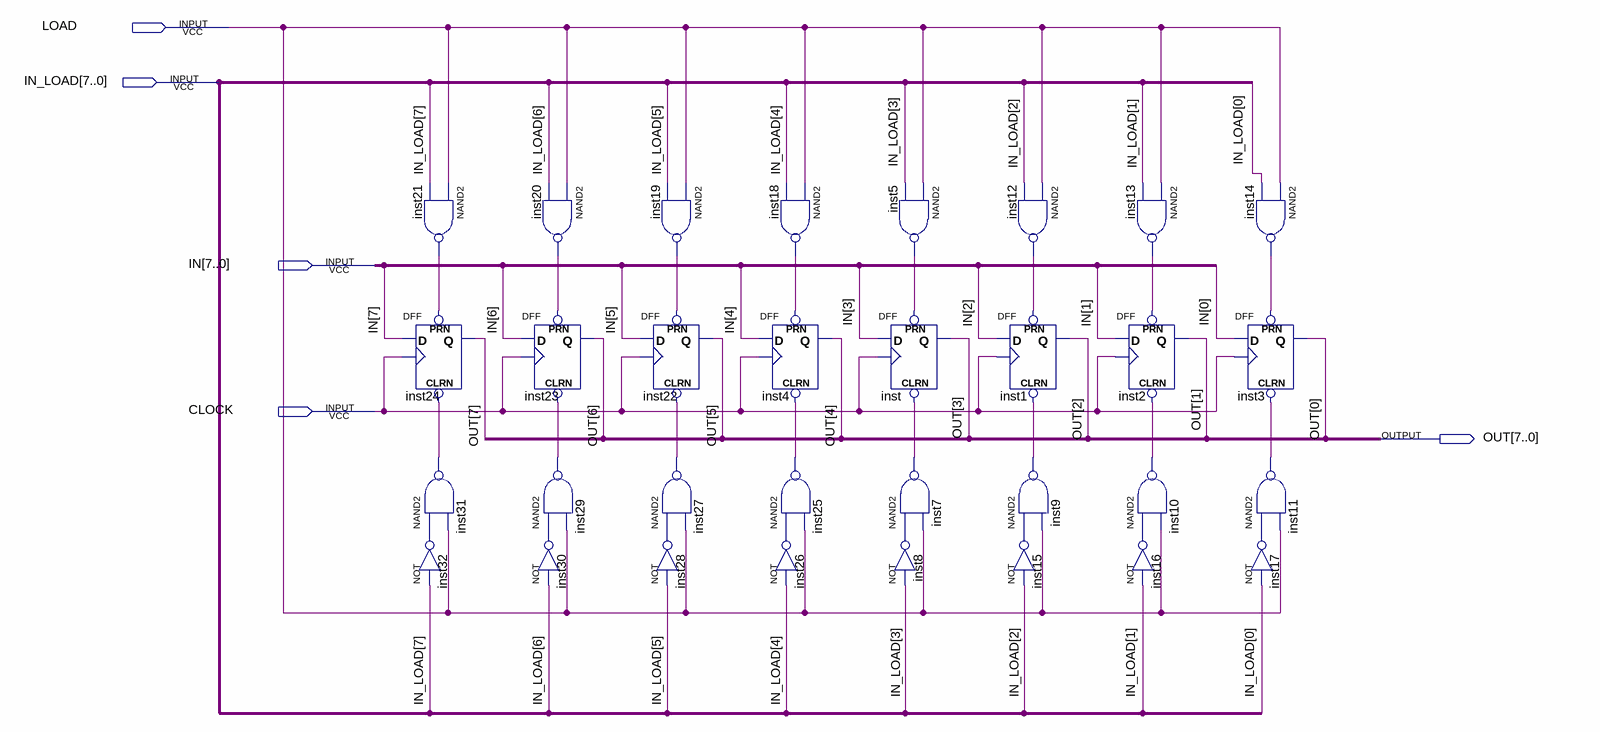
[diagram p0: schematic sheet]
// Quartus schematic Register_8bit.bdf as structural Verilog: 32 symbols, 5 pins
module Register_8bit (
  input  LOAD,
  input  [7:0] IN_LOAD,
  input  [7:0] IN,
  input  CLOCK,
  output [7:0] OUT
);

  wire inst5_out, inst7_out, inst8_out, inst9_out, inst10_out, inst11_out, inst12_out, inst13_out,
       inst14_out, inst15_out, inst16_out, inst17_out, inst18_out, inst19_out, inst20_out, inst21_out,
       inst25_out, inst26_out, inst27_out, inst28_out, inst29_out, inst30_out, inst31_out, inst32_out;

  nand inst21 (inst21_out, LOAD, IN_LOAD[7]);
  DFF inst24 (.CLRN(inst31_out), .CLK(CLOCK), .D(IN[7]), .PRN(inst21_out), .Q(OUT[7]));
  nand inst31 (inst31_out, inst32_out, LOAD);
  not inst32 (inst32_out, IN_LOAD[7]);
  DFF inst23 (.CLRN(inst29_out), .CLK(CLOCK), .D(IN[6]), .PRN(inst20_out), .Q(OUT[6]));
  nand inst20 (inst20_out, LOAD, IN_LOAD[6]);
  nand inst29 (inst29_out, inst30_out, LOAD);
  not inst30 (inst30_out, IN_LOAD[6]);
  nand inst19 (inst19_out, LOAD, IN_LOAD[5]);
  DFF inst22 (.CLRN(inst27_out), .CLK(CLOCK), .D(IN[5]), .PRN(inst19_out), .Q(OUT[5]));
  nand inst27 (inst27_out, inst28_out, LOAD);
  not inst28 (inst28_out, IN_LOAD[5]);
  nand inst18 (inst18_out, LOAD, IN_LOAD[4]);
  DFF inst4 (.CLRN(inst25_out), .CLK(CLOCK), .D(IN[4]), .PRN(inst18_out), .Q(OUT[4]));
  nand inst25 (inst25_out, inst26_out, LOAD);
  not inst26 (inst26_out, IN_LOAD[4]);
  nand inst5 (inst5_out, LOAD, IN_LOAD[3]);
  DFF inst (.CLRN(inst7_out), .CLK(CLOCK), .D(IN[3]), .PRN(inst5_out), .Q(OUT[3]));
  nand inst7 (inst7_out, inst8_out, LOAD);
  not inst8 (inst8_out, IN_LOAD[3]);
  nand inst12 (inst12_out, LOAD, IN_LOAD[2]);
  DFF inst1 (.CLRN(inst9_out), .CLK(CLOCK), .D(IN[2]), .PRN(inst12_out), .Q(OUT[2]));
  nand inst9 (inst9_out, inst15_out, LOAD);
  not inst15 (inst15_out, IN_LOAD[2]);
  nand inst13 (inst13_out, LOAD, IN_LOAD[1]);
  DFF inst2 (.CLRN(inst10_out), .CLK(CLOCK), .D(IN[1]), .PRN(inst13_out), .Q(OUT[1]));
  nand inst10 (inst10_out, inst16_out, LOAD);
  not inst16 (inst16_out, IN_LOAD[1]);
  nand inst14 (inst14_out, LOAD, IN_LOAD[0]);
  DFF inst3 (.CLRN(inst11_out), .CLK(CLOCK), .D(IN[0]), .PRN(inst14_out), .Q(OUT[0]));
  nand inst11 (inst11_out, inst17_out, LOAD);
  not inst17 (inst17_out, IN_LOAD[0]);
endmodule
